# Altium schematic sheet adc-dac.SchDoc
size 297 x 209 mm
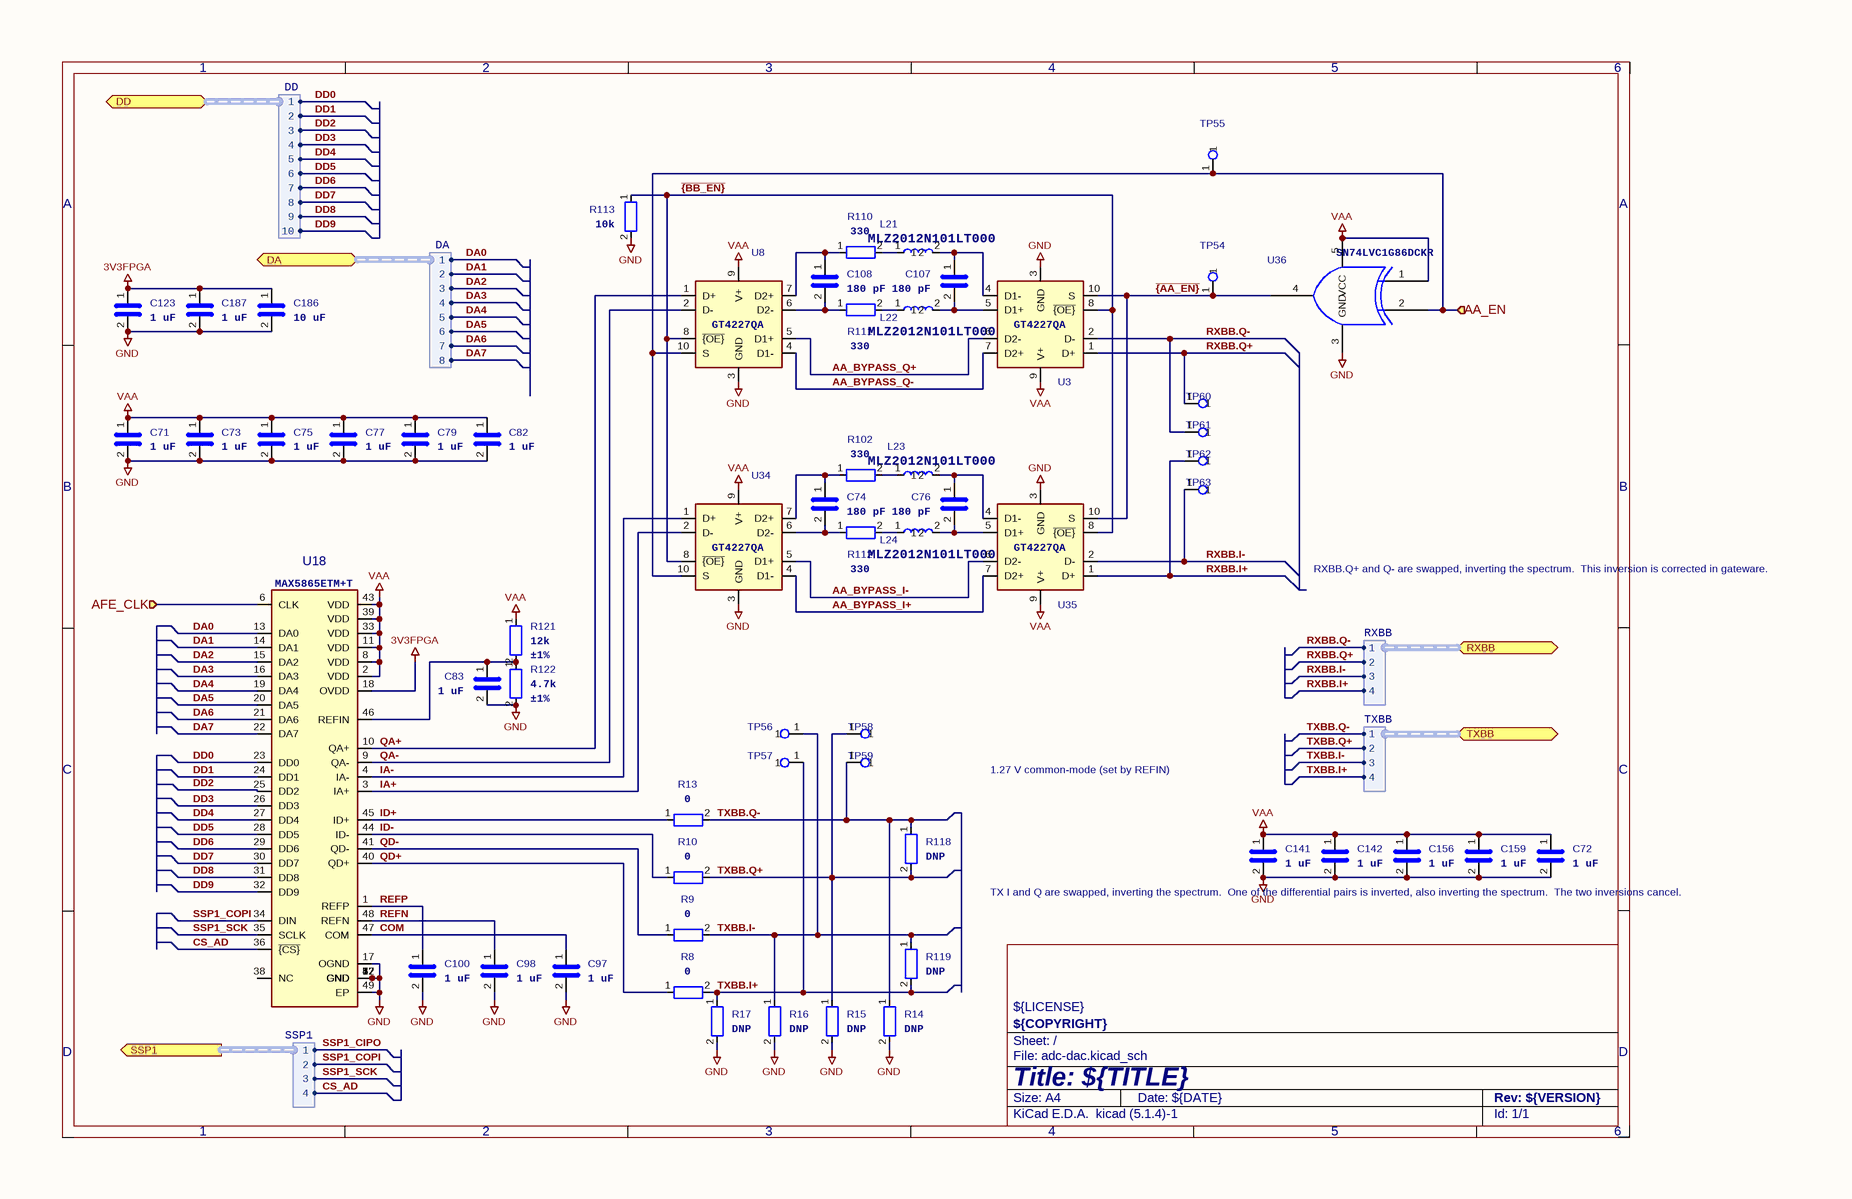
[diagram p0: adc-dac.SchDoc]

## Parts
C71  1 uF  [C_0201_0603Metric]
C72  1 uF  [C_0201_0603Metric]
C73  1 uF  [C_0201_0603Metric]
C74  180 pF  [C_0201_0603Metric]
C75  1 uF  [C_0201_0603Metric]
C76  180 pF  [C_0201_0603Metric]
C77  1 uF  [C_0201_0603Metric]
C79  1 uF  [C_0201_0603Metric]
C82  1 uF  [C_0201_0603Metric]
C83  1 uF  [C_0201_0603Metric]
C97  1 uF  [C_0201_0603Metric]
C98  1 uF  [C_0201_0603Metric]
C100  1 uF  [C_0201_0603Metric]
C107  180 pF  [C_0201_0603Metric]
C108  180 pF  [C_0201_0603Metric]
C123  1 uF  [C_0201_0603Metric]
C141  1 uF  [C_0201_0603Metric]
C142  1 uF  [C_0201_0603Metric]
C156  1 uF  [C_0201_0603Metric]
C159  1 uF  [C_0201_0603Metric]
C186  10 uF  [C_0805_2012Metric]
C187  1 uF  [C_0201_0603Metric]
L21  Part Number: MLZ2012N101LT000  [L_TDK_MLZ2012_h1.25mm]  (hidden comment: 100 uH)
L22  Part Number: MLZ2012N101LT000  [L_TDK_MLZ2012_h1.25mm]  (hidden comment: 100 uH)
L23  Part Number: MLZ2012N101LT000  [L_TDK_MLZ2012_h1.25mm]  (hidden comment: 100 uH)
L24  Part Number: MLZ2012N101LT000  [L_TDK_MLZ2012_h1.25mm]  (hidden comment: 100 uH)
R8  0  [R_0201_0603Metric]
R9  0  [R_0201_0603Metric]
R10  0  [R_0201_0603Metric]
R13  0  [R_0201_0603Metric]
R14  DNP  [R_0201_0603Metric]
R15  DNP  [R_0201_0603Metric]
R16  DNP  [R_0201_0603Metric]
R17  DNP  [R_0201_0603Metric]
R102  330  [R_0201_0603Metric]
R110  330  [R_0201_0603Metric]
R111  330  [R_0201_0603Metric]
R112  330  [R_0201_0603Metric]
R113  10k  [R_0402_1005Metric]
R118  DNP  [R_0201_0603Metric]
R119  DNP  [R_0201_0603Metric]
R121  Tolerance: ±1%  [R_0201_0603Metric]  (hidden comment: 12k)
R122  Tolerance: ±1%  [R_0201_0603Metric]  (hidden comment: 4.7k)
TP54  TestPoint  [TestPoint_Pad_D1.0mm]  (value not drawn)
TP55  TestPoint  [TestPoint_Pad_D1.0mm]  (value not drawn)
TP56  TestPoint  [TestPoint_Pad_D1.0mm]  (value not drawn)
TP57  TestPoint  [TestPoint_Pad_D1.0mm]  (value not drawn)
TP58  TestPoint  [TestPoint_Pad_D1.0mm]  (value not drawn)
TP59  TestPoint  [TestPoint_Pad_D1.0mm]  (value not drawn)
TP60  TestPoint  [TestPoint_Pad_D1.0mm]  (value not drawn)
TP61  TestPoint  [TestPoint_Pad_D1.0mm]  (value not drawn)
TP62  TestPoint  [TestPoint_Pad_D1.0mm]  (value not drawn)
TP63  TestPoint  [TestPoint_Pad_D1.0mm]  (value not drawn)
U3  GT4227  [GTIC_UQFN-10_1.4x1.8mm_P0.4mm]  (value not drawn)
U8  GT4227  [GTIC_UQFN-10_1.4x1.8mm_P0.4mm]  (value not drawn)
U18  Part Number: MAX5865ETM+T  [QFN-48-1EP_7x7mm_P0.5mm_EP5.3x5.3mm_ThermalVias]  (hidden comment: MAX5865)
U34  GT4227  [GTIC_UQFN-10_1.4x1.8mm_P0.4mm]  (value not drawn)
U35  GT4227  [GTIC_UQFN-10_1.4x1.8mm_P0.4mm]  (value not drawn)
U36  Part Number: SN74LVC1G86DCKR  [SOT-353_SC-70-5]  (hidden comment: 74LVC1G86)

## Ports
AA_EN (in), AFE_CLK (in), DA (bidir, harness DA), DD (bidir, harness DD), RXBB (bidir, harness RXBB), SSP1 (out, harness SSP1), TXBB (bidir, harness TXBB)

## Harnesses
DD: 1, 5, 4, 3, 2, 7, 8, 9, 6, 10
DA: 1, 5, 4, 3, 2, 7, 8, 6
TXBB: 1, 4, 3, 2
RXBB: 1, 4, 3, 2
SSP1: 1, 2, 3, 4

## Nets
3V3FPGA: C123.1 C186.1 C187.1 U18.18(OVDD)
GND: C71.2 C72.2 C73.2 C75.2 C77.2 C79.2 C82.2 C83.2 C97.2 C98.2 C100.2 C123.2 C141.2 C142.2 C156.2 C159.2 C186.2 C187.2 R14.2 R15.2 R16.2 R17.2 R113.2 R122.2 U3.3(GND) U8.3(GND) U18.5(GND) U18.7(GND) U18.12(GND) U18.17(OGND) U18.37(GND) U18.42(GND) U18.49(EP) U34.3(GND) U35.3(GND) U36.3(GND)
VAA: C71.1 C72.1 C73.1 C75.1 C77.1 C79.1 C82.1 C141.1 C142.1 C156.1 C159.1 R121.1 U3.9(V+) U8.9(V+) U18.2(VDD) U18.8(VDD) U18.11(VDD) U18.33(VDD) U18.39(VDD) U18.43(VDD) U34.9(V+) U35.9(V+) U36.1 U36.5(VCC)
AA_BYPASS_I+: U34.4(D1-) U35.7(D2+)
AA_BYPASS_I-: U34.5(D1+) U35.6(D2-)
AA_BYPASS_Q+: U3.6(D2-) U8.5(D1+)
AA_BYPASS_Q-: U3.7(D2+) U8.4(D1-)
AA_EN: TP55.1 U8.10(S) U34.10(S) U36.2 ; port AA_EN
AFE_CLK: U18.6(CLK) ; port AFE_CLK
COM: C97.1 U18.47(COM)
CS_AD: U18.36(~{{CS}}) ; port SSP1.4
DA0: U18.13(DA0) ; port DA.1
DA1: U18.14(DA1) ; port DA.2
DA2: U18.15(DA2) ; port DA.3
DA3: U18.16(DA3) ; port DA.4
DA4: U18.19(DA4) ; port DA.5
DA5: U18.20(DA5) ; port DA.6
DA6: U18.21(DA6) ; port DA.7
DA7: U18.22(DA7) ; port DA.8
DD0: U18.23(DD0) ; port DD.1
DD1: U18.24(DD1) ; port DD.2
DD2: U18.25(DD2) ; port DD.3
DD3: U18.26(DD3) ; port DD.4
DD4: U18.27(DD4) ; port DD.5
DD5: U18.28(DD5) ; port DD.6
DD6: U18.29(DD6) ; port DD.7
DD7: U18.30(DD7) ; port DD.8
DD8: U18.31(DD8) ; port DD.9
DD9: U18.32(DD9) ; port DD.10
IA+: U18.3(IA+) U34.2(D-)
IA-: U18.4(IA-) U34.1(D+)
ID+: R13.1 U18.45(ID+)
ID-: R10.1 U18.44(ID-)
QA+: U8.1(D+) U18.10(QA+)
QA-: U8.2(D-) U18.9(QA-)
QD+: R8.1 U18.40(QD+)
QD-: R9.1 U18.41(QD-)
REFN: C98.1 U18.48(REFN)
REFP: C100.1 U18.1(REFP)
RXBB.I+: TP62.1 U35.1(D+) ; port RXBB.4
RXBB.I-: TP63.1 U35.2(D-) ; port RXBB.3
RXBB.Q+: TP60.1 U3.1(D+) ; port RXBB.2
RXBB.Q-: TP61.1 U3.2(D-) ; port RXBB.1
SSP1_CIPO: port SSP1.1
SSP1_COPI: U18.34(DIN) ; port SSP1.2
SSP1_SCK: U18.35(SCLK) ; port SSP1.3
TXBB.I+: R8.2 R17.1 R119.2 TP57.1 ; port TXBB.4
TXBB.I-: R9.2 R16.1 R119.1 TP56.1 ; port TXBB.3
TXBB.Q+: R10.2 R15.1 R118.2 TP58.1 ; port TXBB.2
TXBB.Q-: R13.2 R14.1 R118.1 TP59.1 ; port TXBB.1
~{{AA_EN}}: TP54.1 U3.10(S) U35.10(S) U36.4
~{{BB_EN}}: R113.1 U3.8(~{{OE}}) U8.8(~{{OE}}) U34.8(~{{OE}}) U35.8(~{{OE}})
NetC74_1: C74.1 R102.1 U34.7(D2+)
NetC74_2: C74.2 R112.1 U34.6(D2-)
NetC76_1: C76.1 L23.2 U35.4(D1-)
NetC76_2: C76.2 L24.2 U35.5(D1+)
NetC83_1: C83.1 R121.2 R122.1 U18.46(REFIN)
NetC107_1: C107.1 L21.2 U3.4(D1-)
NetC107_2: C107.2 L22.2 U3.5(D1+)
NetC108_1: C108.1 R110.1 U8.7(D2+)
NetC108_2: C108.2 R111.1 U8.6(D2-)
NetL21_1: L21.1 R110.2
NetL22_1: L22.1 R111.2
NetL23_1: L23.1 R102.2
NetL24_1: L24.1 R112.2

Not connected (* = marked no-connect by the designer): U18 38(NC)

## Notes on the sheet
- RXBB.Q+ and Q- are swapped, inverting
  the spectrum.  This inversion is
  corrected in gateware.
- 1.27 V common-mode
  (set by REFIN)
- TX I and Q are swapped, inverting the
  spectrum.  One of the differential pairs
  is inverted, also inverting the
  spectrum.  The two inversions cancel.
- 1
- 2
- 3
- 4
- 5
- 6
- A
- B
- C
- ${LICENSE}
- D
- Title: ${TITLE}
- File: adc-dac.kicad_sch
- Sheet: /
- ${COPYRIGHT}
- KiCad E.D.A.  kicad (5.1.4)-1
- Size: A4
- Date: ${DATE}
- Rev: ${VERSION}
- Id: 1/1

## Library data of the parts
C71-C73 C75 C77 C79 C82 C83 C97 C98 C100 C123 C141 C142 C156 C159 C187 = C: Manufacturer: Murata; Part Number: GRM033R61A105ME44D; Substitution: GRM033R61A105ME44*, GRM033R61C105ME15*, Samsung CL03A105MO3NRN*; Value: 1 uF; Footprint: Capacitor_SMD:C_0201_0603Metric
C74 C76 C107 C108 = C: Manufacturer: Murata; Part Number: GRM0335C1H181JA01D; Substitution: GRM0335C1H181*; Value: 180 pF; Footprint: Capacitor_SMD:C_0201_0603Metric
C186 = C: Manufacturer: Samsung; Part Number: CL21A106KOQNNNE; Substitution: Murata GRM21BR61A106KE19L; Value: 10 uF; Footprint: Capacitor_SMD:C_0805_2012Metric
L21-L24 = L: Manufacturer: TDK; Substitution: MLZ2012N101LTD25; Value: 100 uH; Footprint: praline:L_TDK_MLZ2012_h1.25mm
R8-R10 R13 = R: Manufacturer: Yageo; Part Number: RC0201JR-070RL; Substitution: any equivalent; Value: 0; Footprint: Resistor_SMD:R_0201_0603Metric
R14-R17 R118 R119 = R: Value: DNP; Footprint: Resistor_SMD:R_0201_0603Metric
R102 R110-R112 = R: Manufacturer: Yageo; Part Number: RC0201JR-07330RL; Substitution: any equivalent; Value: 330; Footprint: Resistor_SMD:R_0201_0603Metric
R113 = R: Manufacturer: Yageo; Part Number: RC0402JR-0710KL; Substitution: any equivalent; Value: 10k; Footprint: Resistor_SMD:R_0402_1005Metric
R121 = R: Manufacturer: Yageo; Part Number: RC0201FR-0712KL; Substitution: any equivalent; Value: 12k; Footprint: Resistor_SMD:R_0201_0603Metric
R122 = R: Manufacturer: Yageo; Part Number: RC0201FR-074K7L; Substitution: any equivalent; Value: 4.7k; Footprint: Resistor_SMD:R_0201_0603Metric
U3 U8 U34 U35 = GT4227QA: Manufacturer: GTIC; Part Number: GT4227QA; Value: GT4227; Footprint: praline:GTIC_UQFN-10_1.4x1.8mm_P0.4mm
U18 = MAX5864: Manufacturer: Maxim; Substitution: MAX5865ETM+; Value: MAX5865; Footprint: praline:QFN-48-1EP_7x7mm_P0.5mm_EP5.3x5.3mm_ThermalVias
U36 = 74LVC1G86: Manufacturer: UMW; Substitution: TI SN74LVC1G86DCKR; Value: 74LVC1G86; Footprint: Package_TO_SOT_SMD:SOT-353_SC-70-5
TP54-TP63 = TestPoint: Value: TestPoint; Footprint: TestPoint:TestPoint_Pad_D1.0mm